# EAGLE design ratio (EAGLE 7.3.0)
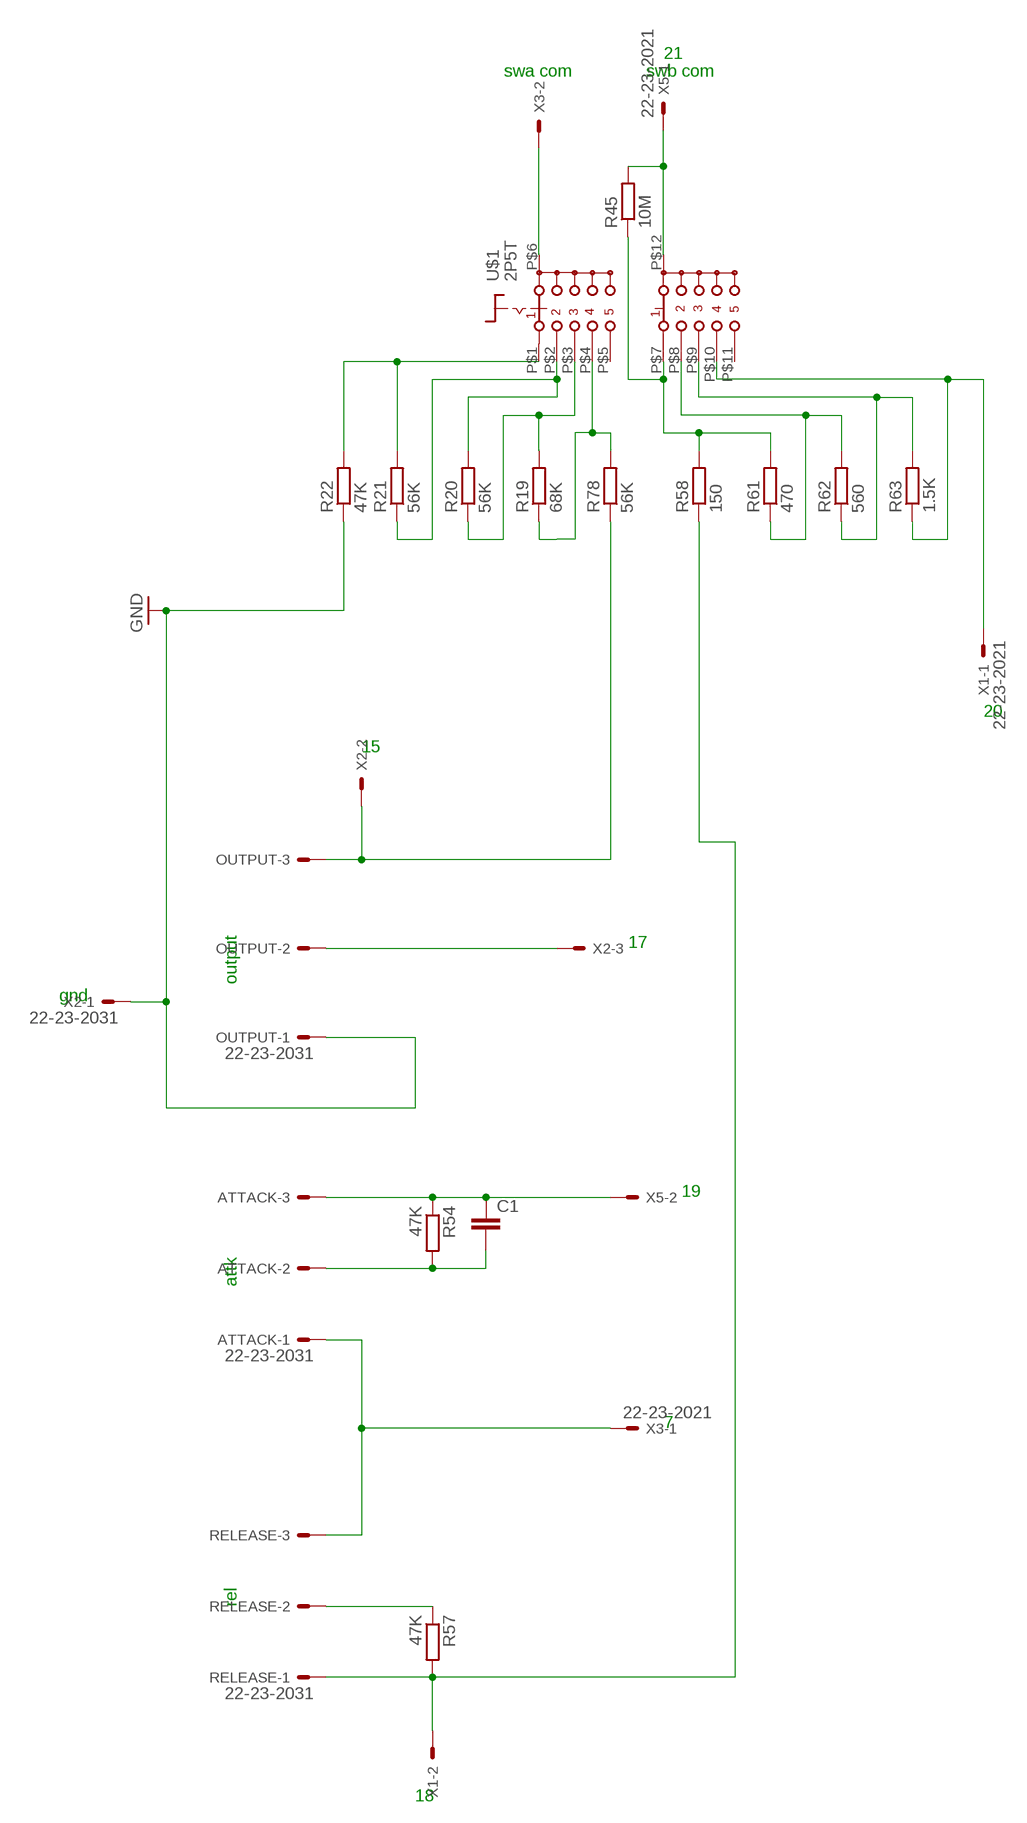
[diagram p0: schematic, sheet 1]

## Parts
ATTACK  22-23-2031  [22-23-2031]
C1  C-EU025-025X050  [C025-025X050]
OUTPUT  22-23-2031  [22-23-2031]
R19  68K  R-EU_0204/2V  [0204V]
R20  56K  R-EU_0204/2V  [0204V]
R21  56K  R-EU_0204/2V  [0204V]
R22  47K  R-EU_0204/2V  [0204V]
R45  10M  R-EU_0204/2V  [0204V]
R54  47K  R-EU_0204/2V  [0204V]
R57  47K  R-EU_0204/2V  [0204V]
R58  150  R-EU_0204/2V  [0204V]
R61  470  R-EU_0204/2V  [0204V]
R62  560  R-EU_0204/2V  [0204V]
R63  1.5K  R-EU_0204/2V  [0204V]
R78  56K  R-EU_0204/2V  [0204V]
RELEASE  22-23-2031  [22-23-2031]
U$1  2P5T  [2P5T]
X1  22-23-2021  [22-23-2021]
X2  22-23-2031  [22-23-2031]
X3  22-23-2021  [22-23-2021]
X5  22-23-2021  [22-23-2021]

## Nets
GND: OUTPUT.1 R22.1 X2.1
N$1: U$1.P$6(A) X3.2
N$2: R45.2 U$1.P$12(C) X5.1
N$3: R21.2 R22.2 U$1.P$1(A1)
N$4: R20.2 R21.1 U$1.P$2(A2)
N$5: R19.2 R20.1 U$1.P$3(A3)
N$6: R19.1 R78.2 U$1.P$4(A4)
N$7: OUTPUT.3 R78.1 X2.2
N$9: R45.1 R58.2 R61.2 U$1.P$7(C1)
N$10: OUTPUT.2 X2.3
N$11: ATTACK.3 C1.1 R54.1 X5.2
N$12: R61.1 R62.2 U$1.P$8(C2)
N$13: R62.1 R63.2 U$1.P$9(C3)
N$14: R63.1 U$1.P$10(C4) X1.1
N$15: ATTACK.2 C1.2 R54.2
N$16: ATTACK.1 RELEASE.3 X3.1
N$17: R57.1 RELEASE.2
N$18: R57.2 R58.1 RELEASE.1 X1.2
Unconnected: U$1.P$5(A5) U$1.P$11(C5)

## Notes on the sheet
- 21
- swa com | swb com
- 20
- 15
- 17
- output
- gnd
- 19
- attk
- 7
- rel
- 18

## Library data of the parts
ATTACK OUTPUT RELEASE X2 = con-molex:22-23-2031: .100" (2.54mm) Center Header - 3 Pin; MF: MOLEX; MPN: 22-23-2031; OC_FARNELL: 1462950; OC_NEWARK: 30C0862
C1 = rcl:C-EU: CAPACITOR, European symbol
R19-R22 R45 R54 R57 R58 R61-R63 R78 = rcl:R-EU_: RESISTOR, European symbol
U$1 = switch:2P5T
X1 X3 X5 = con-molex:22-23-2021: .100" (2.54mm) Center Header - 2 Pin; MF: MOLEX; MPN: 22-23-2021; OC_FARNELL: 1462926; OC_NEWARK: 25C3832

## Board
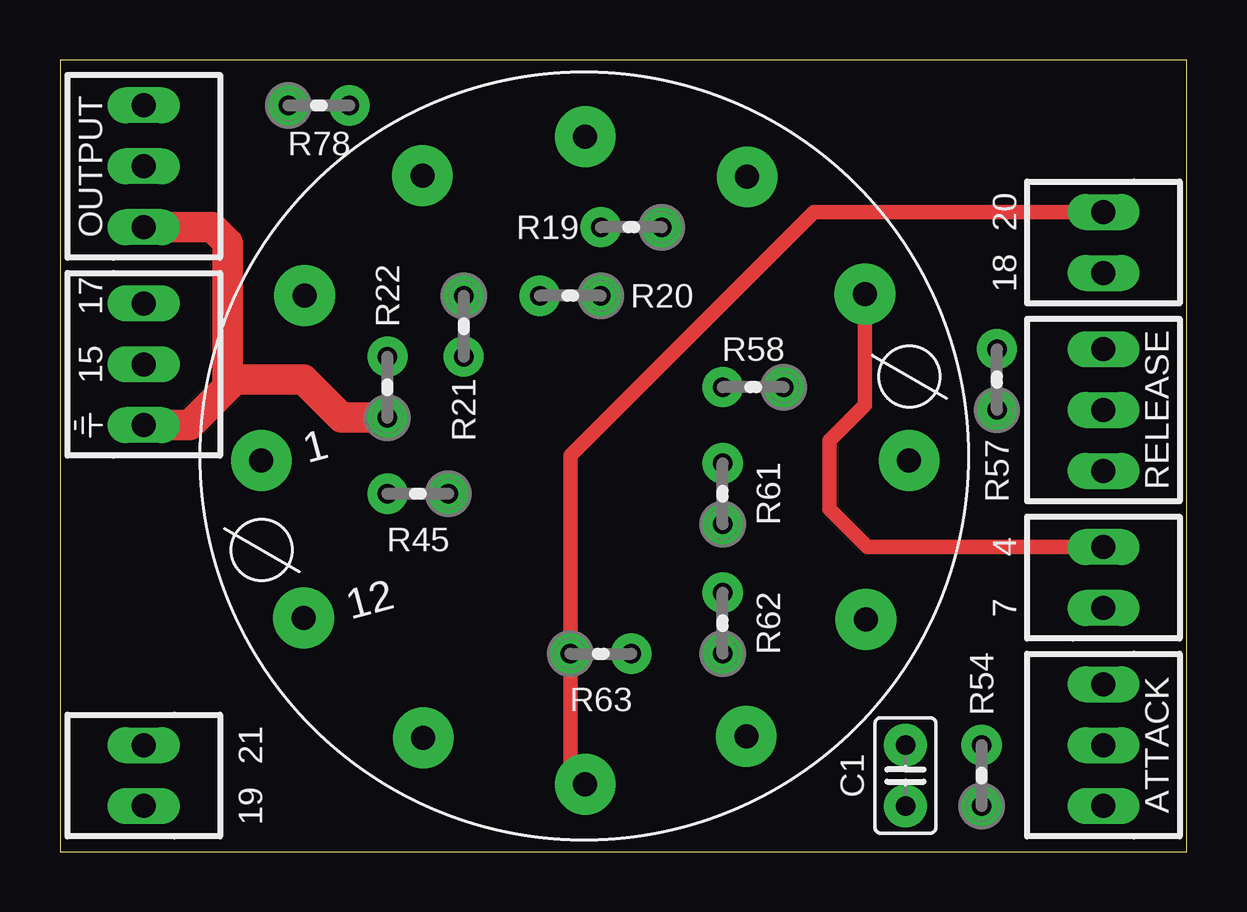
[diagram p1: board, top side]
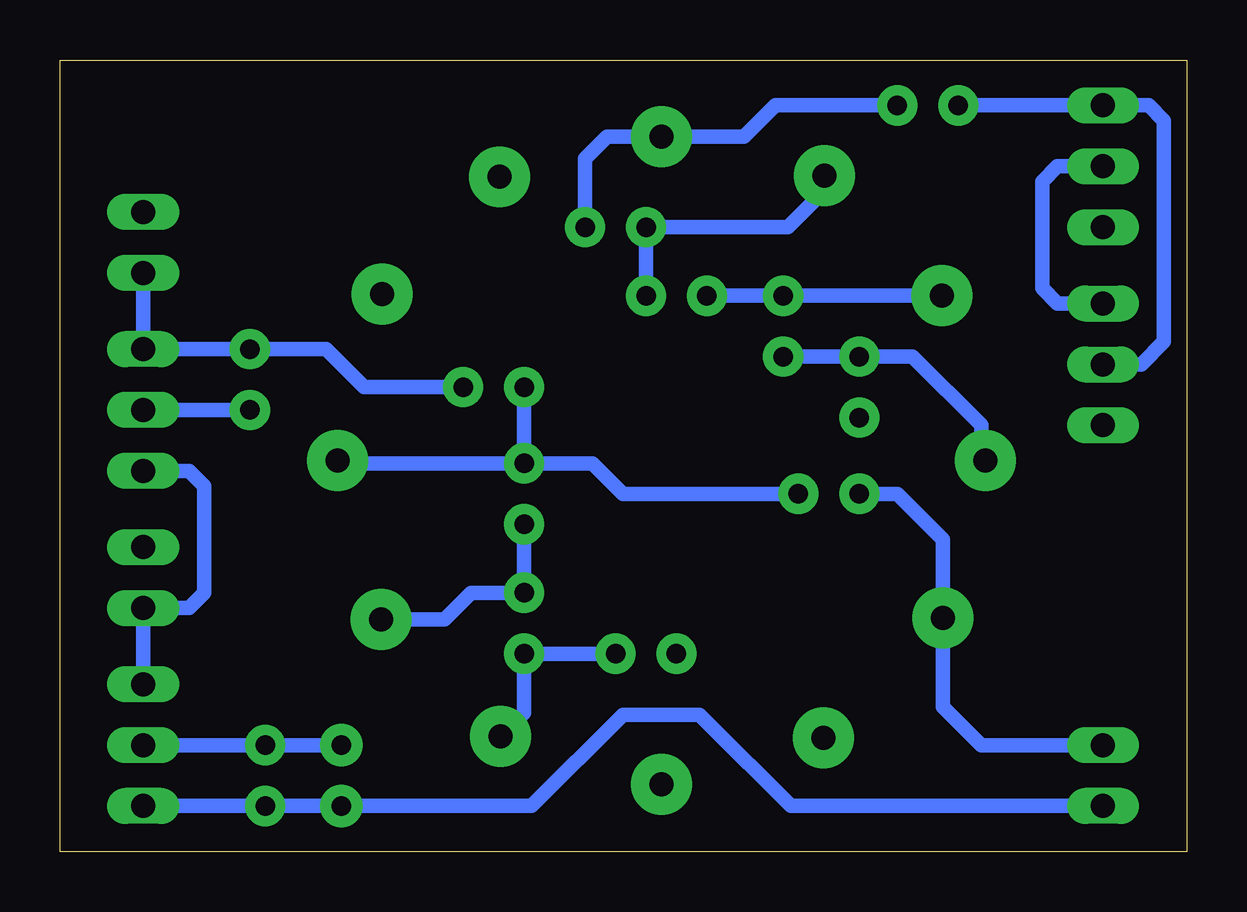
[diagram p2: board, bottom side, seen from below]

Size 46.97 x 33.01 mm. Coordinates in mm from the lower left corner, seen from the top.
Outline: 0,0 46.97,0 46.97,33.01 0,33.01 0,0
Copper layers (1*16): Top 0.035mm / dielectric 1.5mm / Bottom 0.035mm
Design rules "default": minimum track width 10mil, minimum drill 24mil, track to track 8mil, track to pad 8mil, pad to pad 8mil, via to via 8mil, smd to smd 8mil, copper to edge 40mil, drill to drill 8mil, minimum pad ring 10mil, minimum via ring 8mil, stop-mask expansion 4mil, vias tented up to drill 0mil, thermal gap 10mil

### Footprints (pad centres in the part's own frame; a part is rotated, then mirrored left to right if it is on the bottom)
22-23-2031 = drill 1 long: 1 -2.54,0; 2 0,0; 3 2.54,0
C025-025X050 = drill 0.813 pad 1.778: 1 -1.27,0; 2 1.27,0
0204V = drill 0.813 pad 1.676: 1 -1.27,0; 2 1.27,0
2P5T = drill 1 pad 2.54: P$1 -13.022,3.608; P$2 -9.493,9.789; P$3 -3.467,13.346; P$4 3.512,13.154; P$5 9.599,9.789; P$6 13.067,3.8; P$7 13.058,-3.38; P$8 9.599,-9.303; P$9 3.521,-12.734; P$10 -3.476,-12.926; P$11 -9.493,-9.303; P$12 -13.013,-3.188
22-23-2021 = drill 1 long: 1 -1.27,0; 2 1.27,0

### Placement (x,y rotation side)
ATTACK  43.5,4.45 270 top
C1  35.24,3.18 90 top
OUTPUT  3.49,28.57 90 top
R19  23.81,26.04 180 top
R20  21.27,23.18 180 top
R21  16.83,21.91 270 top
R22  13.65,19.37 90 top
R45  14.92,14.92 180 top
R54  38.42,3.18 90 top
R57  39.05,19.69 90 top
R58  28.89,19.37 180 top
R61  27.62,14.92 90 top
R62  27.62,9.52 90 top
R63  22.54,8.25 0 top
R78  10.79,31.12 0 top
RELEASE  43.5,18.42 270 top
U$1  21.91,16.19 15 top
X1  43.5,25.4 270 top
X2  3.49,20.32 90 top
X3  43.5,11.43 90 top
X5  3.49,3.18 270 top

### Tracks (layer width: path | path; a pad name or v marks a point on that pad's centre or on a via)
GND
  Top 1.27: OUTPUT.1 6.35,26.03 6.99,25.4 6.99,19.69 | 6.99,19.69 6.99,19.37 5.4,17.78 X2.1 | R22.1 11.75,18.1 10.16,19.69 6.99,19.69
N$1
  Top 0.61: U$1.P$6 33.55,18.62 32.07,17.14 32.07,14.29 33.34,13.02 33.65,12.7 X3.2
N$2
  Bottom 0.61: X5.1 8.57,4.45 8.89,4.76 10.16,6.04 U$1.P$12 10.16,13.02 12.07,14.92 R45.2
N$3
  Bottom 0.61: R21.2 R22.2 11.43,20.64 8.57,17.78 8.57,16.48 U$1.P$1
N$4
  Bottom 0.61: R20.2 R21.1 10.22,23.18 U$1.P$2
N$5
  Bottom 0.61: R20.1 R19.2 16.62,26.03 15.1,27.55 U$1.P$3
N$6
  Bottom 0.61: R19.1 25.08,28.89 24.17,29.81 U$1.P$4 18.45,29.81 17.15,31.12 R78.2
N$7
  Bottom 0.61: R78.1 OUTPUT.3 1.59,31.12 0.95,30.48 0.95,21.27 1.91,20.32 X2.2
N$9
  Bottom 0.61: R58.2 R61.2 | R61.2 34.65,16.19 U$1.P$7 | R45.1 23.5,14.92 24.77,16.19 R61.2
N$10
  Bottom 0.61: OUTPUT.2 5.4,28.57 6.03,27.94 6.03,23.49 5.4,22.86 X2.3
N$11
  Bottom 0.61: X5.2 13.97,1.91 16.51,1.91 20,5.4 20.32,5.71 23.5,5.71 27.31,1.91 28.57,1.91 C1.1 R54.1 43.18,1.91 ATTACK.3
N$12
  Bottom 0.61: R61.1 R62.2 29.84,10.8 30.95,9.69 U$1.P$8
N$13
  Bottom 0.61: R63.2 R62.1 27.62,5.79 U$1.P$9
N$14
  Top 0.61: X1.1 37.78,26.67 31.43,26.67 21.59,16.83 21.27,16.51 R63.1 21.27,3.43 U$1.P$10
N$15
  Bottom 0.61: C1.2 R54.2 42.86,4.45 ATTACK.2
N$16
  Bottom 0.61: ATTACK.1 X3.1 41.59,10.16 40.96,10.8 40.96,15.24 41.59,15.87 RELEASE.3
N$17
  Bottom 0.61: R57.1 RELEASE.2
N$18
  Bottom 0.61: X1.2 RELEASE.1 40.96,20.96 R57.2 35.88,20.96 34.29,19.37 R58.1

### Text on the board
tNames: 20 | 18 | 17 | 15 | 4 | 7 | 21 | 19